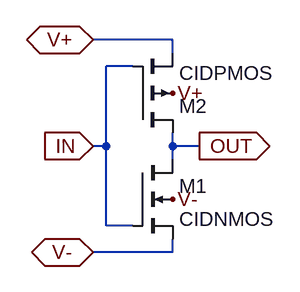
[diagram p0: schematic NOT.asc]
NOT.asc, the LTspice schematic file:
Version 4.1
SHEET 1 880 680
WIRE 256 16 160 16
WIRE 256 32 256 16
WIRE 208 48 176 48
WIRE 176 144 176 48
WIRE 176 144 160 144
WIRE 256 144 256 128
WIRE 288 144 256 144
WIRE 256 160 256 144
WIRE 176 240 176 144
WIRE 208 240 176 240
WIRE 256 272 256 256
WIRE 256 272 160 272
FLAG 160 144 IN
IOPIN 160 144 In
FLAG 288 144 OUT
IOPIN 288 144 Out
FLAG 160 272 V-
IOPIN 160 272 BiDir
FLAG 256 208 V-
FLAG 160 16 V+
IOPIN 160 16 BiDir
FLAG 256 80 V+
SYMBOL nmos4 208 160 R0
SYMATTR InstName M1
SYMATTR Value CIDNMOS
SYMATTR Value2 l=5u w=10u
SYMBOL pmos4 208 128 M180
SYMATTR InstName M2
SYMATTR Value CIDPMOS
SYMATTR Value2 l=5u w=25u

The netlist it stands for:
* NOT.asc
M1 OUT IN V- V- CIDNMOS l=5u w=10u
M2 OUT IN V+ V+ CIDPMOS l=5u w=25u
.model NMOS NMOS
.model PMOS PMOS
.lib standard.mos
.backanno
.end